# EAGLE design main (EAGLE 5.11)
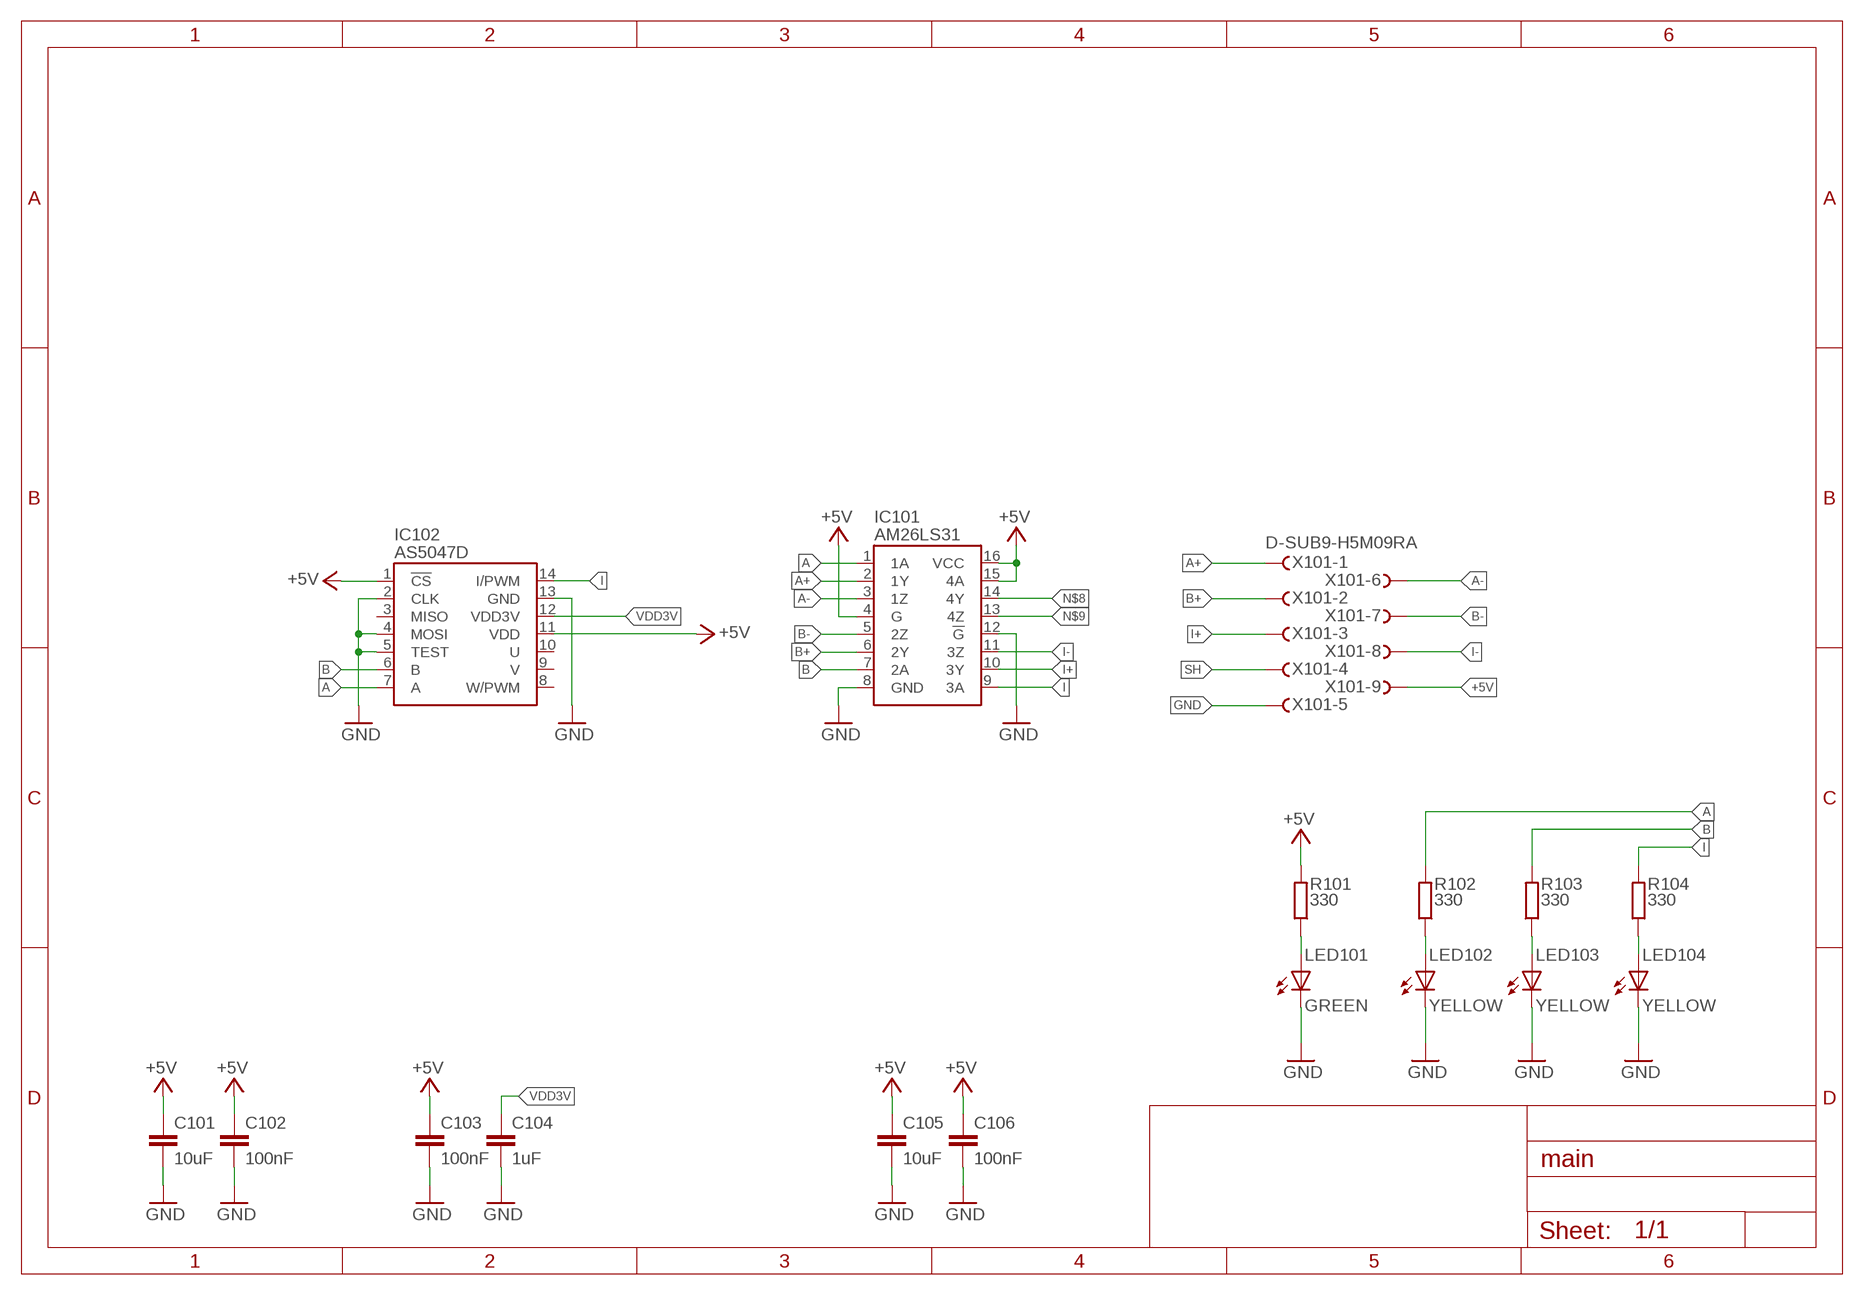
[diagram p0: schematic, sheet 1]

## Parts
C101  10uF  C-EUC0805  [C0805]
C102  100nF  C-EUC0603  [C0603]
C103  100nF  C-EUC0603  [C0603]
C104  1uF  C-EUC0805  [C0805]
C105  10uF  C-EUC0805  [C0805]
C106  100nF  C-EUC0603  [C0603]
IC101  AM26LS31  [DIL16]
IC102  AS5047D  [TSSOP14]
LED101  GREEN  LED5MM  [LED5MM]
LED102  YELLOW  LED5MM  [LED5MM]
LED103  YELLOW  LED5MM  [LED5MM]
LED104  YELLOW  LED5MM  [LED5MM]
R101  330  R-EU_0207/10  [0207/10]
R102  330  R-EU_0207/10  [0207/10]
R103  330  R-EU_0207/10  [0207/10]
R104  330  R-EU_0207/10  [0207/10]
X101  D-SUB9-H5M09RA  [H5M09RA]

## Nets
+5V: C101.1 C102.1 C103.1 C105.1 C106.1 IC101.4(G) IC101.15(4A) IC101.16(VCC) IC102.1(!CS) IC102.11(VDD) R101.2 X101.9
A: IC101.1(1A) IC102.7(A) R102.2
A+: IC101.2(1Y) X101.1
A-: IC101.3(1Z) X101.6
B: IC101.7(2A) IC102.6(B) R103.2
B+: IC101.6(2Y) X101.2
B-: IC101.5(2Z) X101.7
GND: C101.2 C102.2 C103.2 C104.2 C105.2 C106.2 IC101.8(GND) IC101.12(!G) IC102.2(CLK) IC102.4(MOSI) IC102.5(TEST) IC102.13(GND) LED101.K(C) LED102.K(C) LED103.K(C) LED104.K(C) X101.5
I: IC101.9(3A) IC102.14(I/PWM) R104.2
I+: IC101.10(3Y) X101.3
I-: IC101.11(3Z) X101.8
N$8: IC101.14(4Y)
N$9: IC101.13(4Z)
N$10: LED101.A R101.1
N$11: LED102.A R102.1
N$12: LED103.A R103.1
N$13: LED104.A R104.1
SH: X101.4
VDD3V: C104.1 IC102.12(VDD3V)
Unconnected: IC102.3(MISO) IC102.8(W/PWM) IC102.9(V) IC102.10(U)

## Library data of the parts
C101-C106 = rcl:C-EU: CAPACITOR, European symbol
IC101 = myIC:AM26LS31*
IC102 = myAMS:AS5047D
LED101-LED104 = led:LED: LED OSRAM: - CHIPLED LG R971, LG N971, LY N971, LG Q971, LY Q971, LO R971, LY R971 LH N974, LH R974 LS Q976, LO Q976, LY Q976 LO Q996 - Hyper CHIPLED LW Q18S LB Q993, LB Q99A, LB R99A - SideLED LS A670, LO A670, LY A670, LG A670, LP A670 LB A673, LV A673, LT A673, LW A673 LH A674 LY A675 LS A676, LA A676, LO A676, LY A676, LW A676 LS A679, LY A679, LG A679 - Hyper Micro SIDELED® LS Y876, LA Y876, LO Y876, LY Y876 LT Y87S - SmartLED LW L88C, LW L88S LB L89C, LB L89S, LG L890 LS L89K, LO L89K, LY L89K LS L896, LA L896, LO L896, LY L896 - TOPLED LS T670, LO T670, LY T670, LG T670, LP T670 LSG T670, LSP T670, LSY T670, LOP T670, LYG T670 LG T671, LOG T671, LSG T671 LB T673, LV T673, LT T673, LW T673 LH T674 LS T676, LA T676, LO T676, LY T676, LB T676, LH T676, LSB T676, LW T676 LB T67C, LV T67C, LT T67C, LS T67K, LO T67K, LY T67K, LW E67C LS E67B, LA E67B, LO E67B, LY E67B, LB E67C, LV E67C, LT E67C LW T67C LS T679, LY T679, LG T679 LS T770, LO T770, LY T770, LG T770, LP T770 LB T773, LV T773, LT T773, LW T773 LH T774 LS E675, LA E675, LY E675, LS T675 LS T776, LA T776, LO T776, LY T776, LB T776 LHGB T686 LT T68C, LB T68C - Hyper Mini TOPLED® LB M676 - Mini TOPLED Santana® LG M470 LS M47K, LO M47K, LY M47K Source: http://www.osram.convergy.de LUXEON: - LUMILED® LXK2-PW12-R00, LXK2-PW12-S00, LXK2-PW14-U00, LXK2-PW14-V00 LXK2-PM12-R00, LXK2-PM12-S00, LXK2-PM14-U00 LXK2-PE12-Q00, LXK2-PE12-R00, LXK2-PE12-S00, LXK2-PE14-T00, LXK2-PE14-U00 LXK2-PB12-K00, LXK2-PB12-L00, LXK2-PB12-M00, LXK2-PB14-N00, LXK2-PB14-P00, LXK2-PB14-Q00 LXK2-PR12-L00, LXK2-PR12-M00, LXK2-PR14-Q00, LXK2-PR14-R00 LXK2-PD12-Q00, LXK2-PD12-R00, LXK2-PD12-S00 LXK2-PH12-R00, LXK2-PH12-S00 LXK2-PL12-P00, LXK2-PL12-Q00, LXK2-PL12-R00 Source: www.luxeon.com KINGBRIGHT: KA-3528ASYC Source: www.kingbright.com
R101-R104 = rcl:R-EU_: RESISTOR, European symbol
X101 = con-thomas-betts:D-SUB9-: D-Subminiatur Connector Source: Electronioc Interconnects European Edition 1998; OC_FARNELL: unknown; OC_NEWARK: unknown

## Board
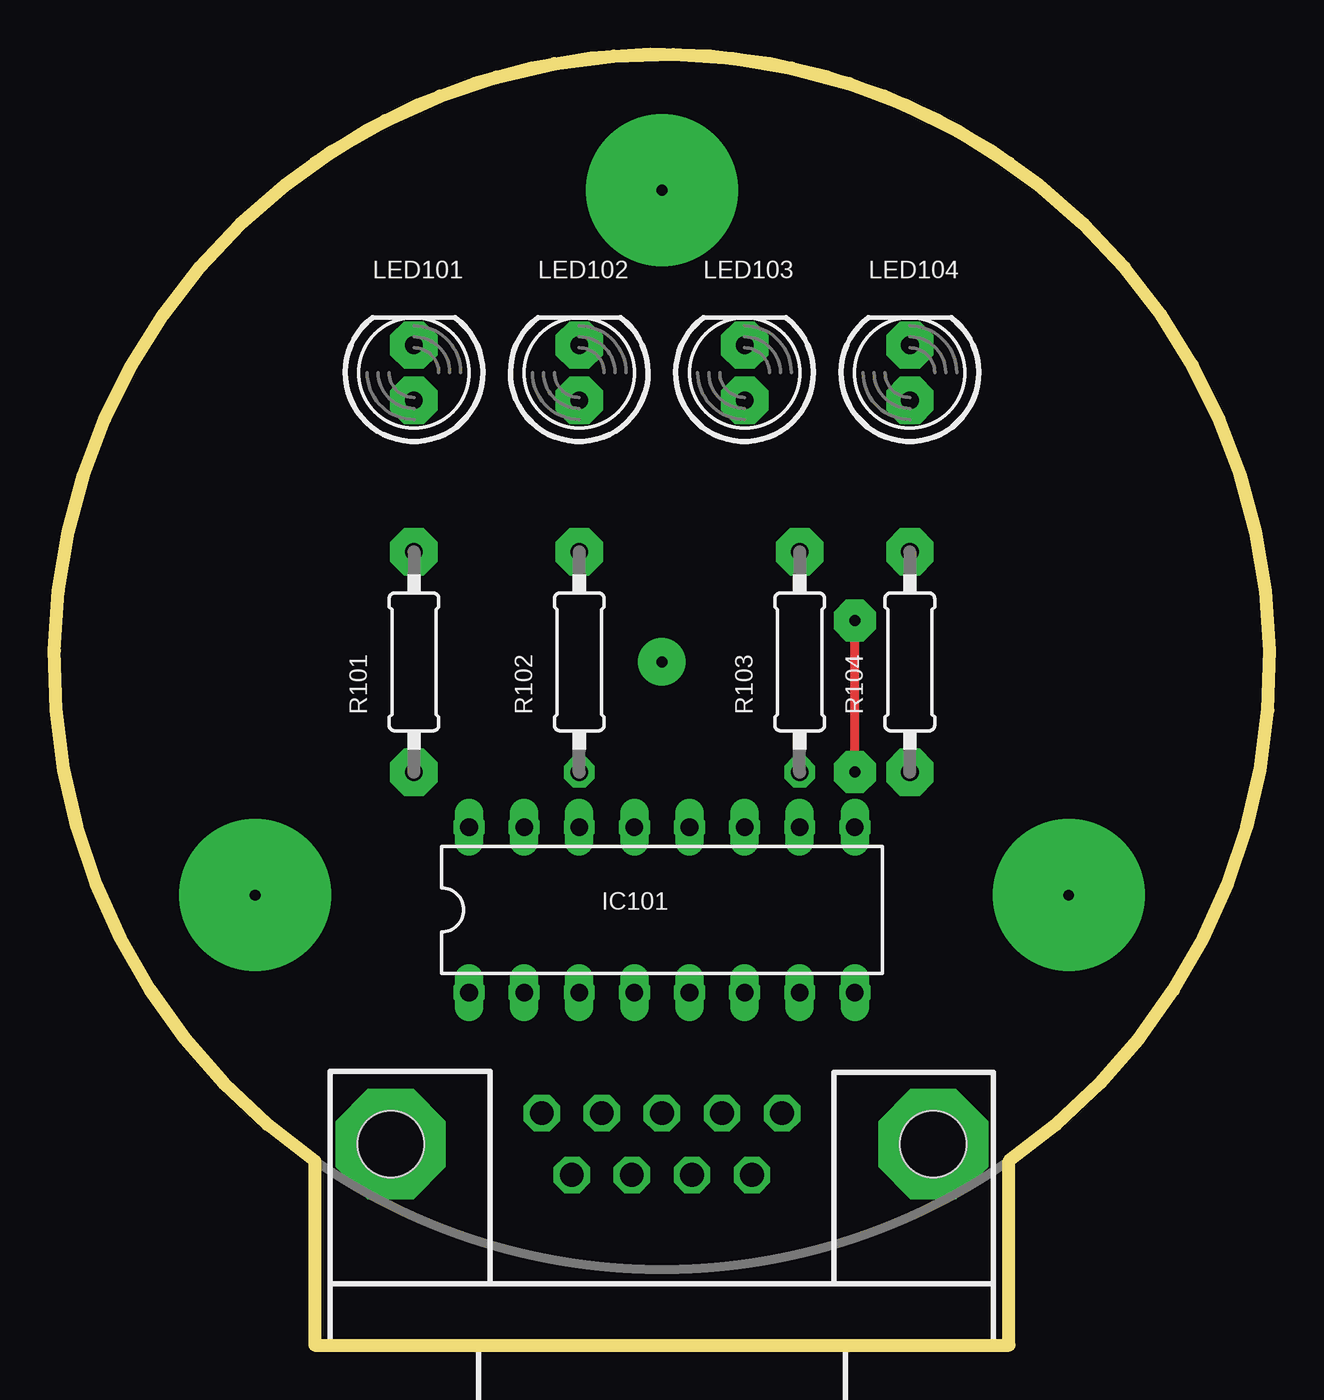
[diagram p1: board, top side]
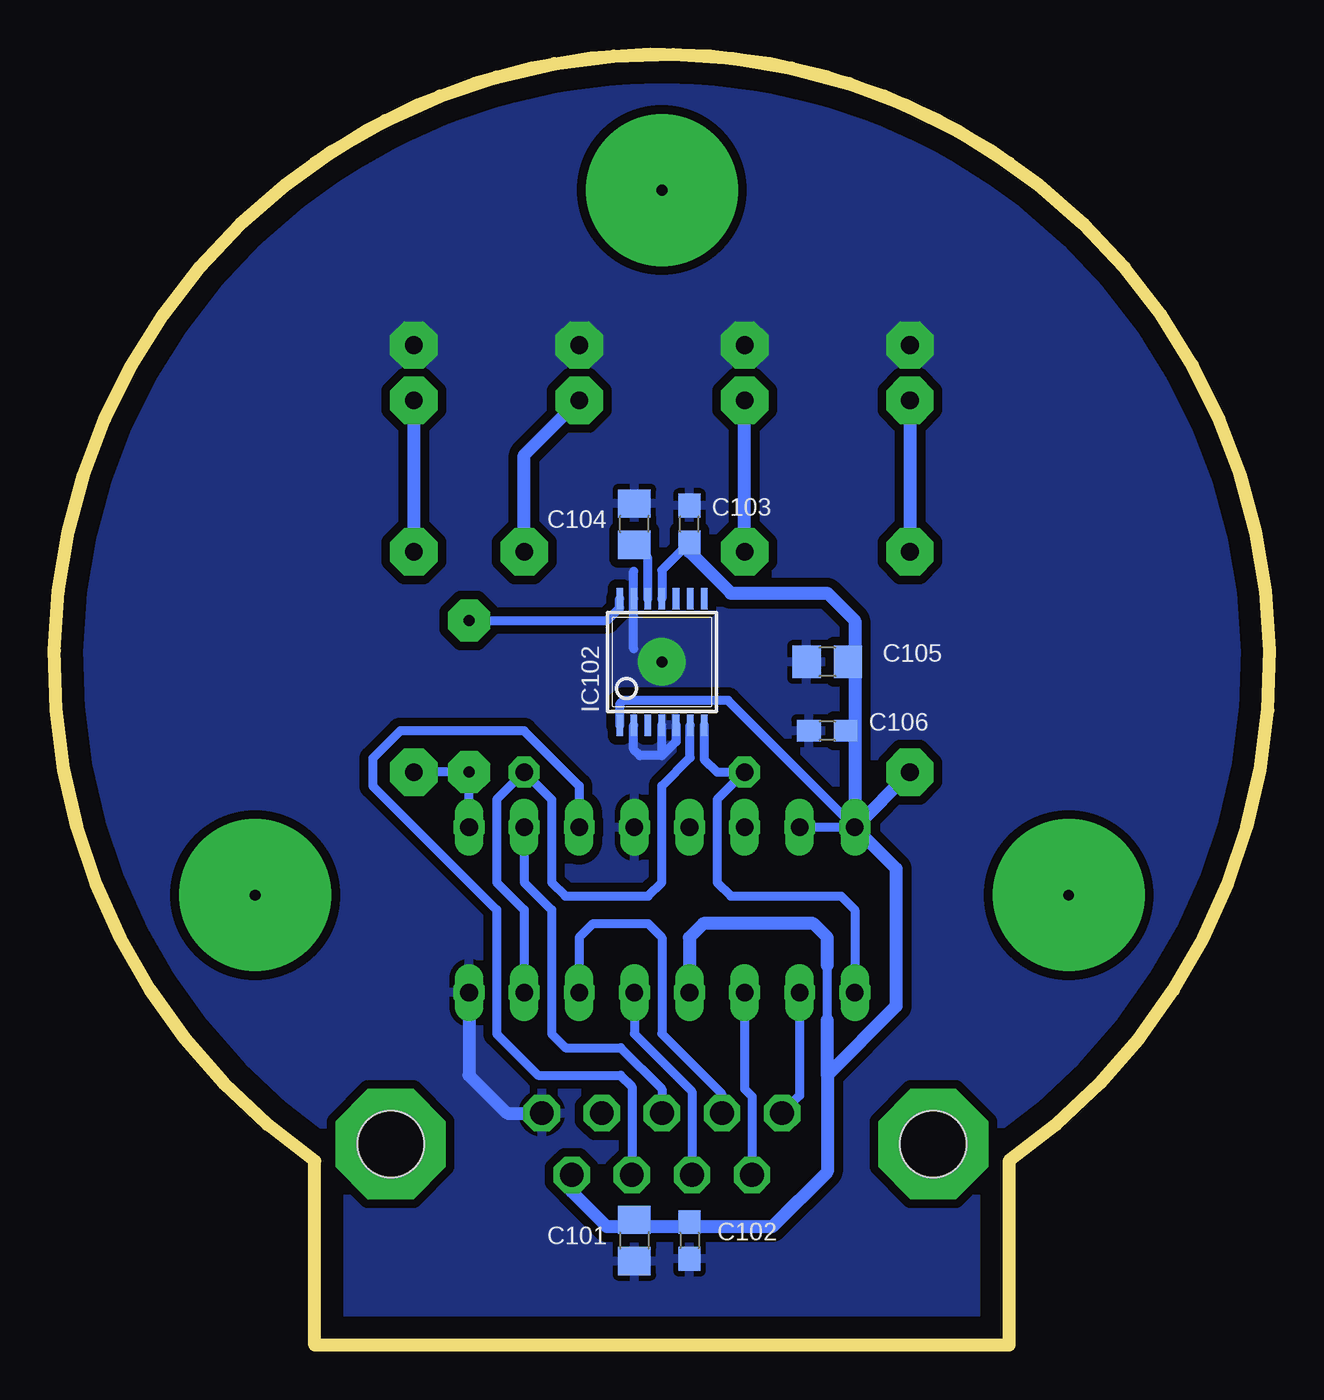
[diagram p2: board, bottom side, seen from below]

Size 56.03 x 59.51 mm. Coordinates in mm from the lower left corner, seen from the top.
Outline: 44.01,54.5 arc180 12.01,8.5 12.01,0 44.01,0 44.01,8.5 arc180 12.01,54.5
Copper layers (1*16): Top 0.035mm / dielectric 1.5mm / Bottom 0.035mm
Design rules "default *": minimum track width 10mil, minimum drill 24mil, track to track 8mil, track to pad 8mil, pad to pad 8mil, via to via 8mil, smd to smd 8mil, copper to edge 40mil, drill to drill 8mil, minimum pad ring 10mil, minimum via ring 8mil, stop-mask expansion 4mil, vias tented up to drill 0mil, thermal gap 10mil

### Footprints (pad centres in the part's own frame; a part is rotated, then mirrored left to right if it is on the bottom)
C0805 = smd 1.3 x 1.5: 1 -0.95,0; 2 0.95,0
C0603 = smd 1.1 x 1: 1 -0.85,0; 2 0.85,0
DIL16 = drill 0.813 long: 1 -8.89,-3.81; 2 -6.35,-3.81; 3 -3.81,-3.81; 4 -1.27,-3.81; 5 1.27,-3.81; 6 3.81,-3.81; 7 6.35,-3.81; 8 8.89,-3.81; 9 8.89,3.81; 10 6.35,3.81; 11 3.81,3.81; 12 1.27,3.81; 13 -1.27,3.81; 14 -3.81,3.81; 15 -6.35,3.81; 16 -8.89,3.81
TSSOP14 = smd 0.305 x 0.991: 1 -1.95,-2.918; 2 -1.3,-2.918; 3 -0.65,-2.918; 4 0,-2.918; 5 0.65,-2.918; 6 1.3,-2.918; 7 1.95,-2.918; 8 1.95,2.918; 9 1.3,2.918; 10 0.65,2.918; 11 0,2.918; 12 -0.65,2.918; 13 -1.3,2.918; 14 -1.95,2.918
LED5MM = drill 0.813 octagon: A -1.27,0; K 1.27,0
0207/10 = drill 0.813 octagon: 1 -5.08,0; 2 5.08,0
H5M09RA = drill 1.092 round: 1 -5.537,1.422; 2 -2.769,1.422; 3 0,1.422; 4 2.769,1.422; 5 5.537,1.422; 6 -4.153,-1.422; 7 -1.384,-1.422; 8 1.384,-1.422; 9 4.153,-1.422 | hole 3.048: -12.497,0; 12.497,0

### Placement (x,y rotation side)
C101  29.28,4.83 270 bottom
C102  26.74,4.83 270 bottom
C103  26.74,37.85 90 bottom
C104  29.28,37.85 90 bottom
C105  20.39,31.5 180 bottom
C106  20.39,28.32 180 bottom
IC101  28.01,20.07 0 top
IC102  28.01,31.5 0 bottom
LED101  16.58,44.84 90 top
LED102  24.2,44.84 90 top
LED103  31.82,44.84 90 top
LED104  39.44,44.84 90 top
R101  16.58,31.5 270 top
R102  24.2,31.5 270 top
R103  34.36,31.5 270 top
R104  39.44,31.5 270 top
X101  28.01,9.27 0 top

### Tracks (layer width: path | path; a pad name or v marks a point on that pad's centre or on a via)
+5V  (via drill 0.5 pad 1.42, 0.5 pad 1.68, 0.5 pad 2.18)
  Bottom 0.406: 20.39,14.99 20.39,17.53 | IC102.1 29.96,29.55 29.79,29.72 24.96,29.72 IC101.16 IC101.15 | IC102.11 28.01,35.73 C103.1 | 29.28,5.46 C101.1 | 26.74,5.46 C102.1 | 19.12,28.32 C106.1 | 19.12,31.5 C105.1
  Bottom 0.61: IC101.4 26.74,18.8 26.11,19.44 21.03,19.44 20.39,18.8 20.39,17.53 | X101.9 32.17,7.08 30.55,5.46 29.28,5.46 26.74,5.46 22.93,5.46 20.39,8 20.39,12.45 | 20.39,12.45 17.22,15.62 17.22,21.98 IC101.16 | IC101.16 19.12,28.32 19.12,31.5 19.12,33.41 20.39,34.67 24.84,34.67 26.74,36.58 C103.1 | 20.39,12.45 20.39,14.99 | IC101.16 R101.2
  other vias: 26.74,16.26 19.12,23.88 32.17,7.85 21.66,23.88 16.58,26.42
A  (via drill 0.5 pad 1.42)
  Bottom 0.406: IC101.1 19.12,20.07 19.76,20.7 24.84,20.7 25.47,21.34 25.47,25.15 R102.2 25.47,26.42 26.06,27.01 IC102.7
  other vias: 19.12,16.26 24.2,26.42
A+  (via drill 0.5 pad 1.42, 0.5 pad 1.68)
  Bottom 0.406: IC101.2 21.66,11.51 X101.1
  other vias: 21.66,16.26 22.48,10.7
A-  (via drill 0.5 pad 1.42, 0.5 pad 1.68)
  Bottom 0.406: X101.6 23.86,11.47 24.2,11.82 IC101.3
  other vias: 24.2,16.26 23.86,7.85
B  (via drill 0.5 pad 1.42)
  Bottom 0.406: IC102.6 26.71,27.09 28.01,25.79 28.01,21.34 28.65,20.7 32.46,20.7 33.09,21.34 33.09,25.15 R103.2 35.63,25.15 35.63,21.34 34.36,20.07 IC101.7
  other vias: 34.36,16.26 34.36,26.42
B+  (via drill 0.5 pad 1.42, 0.5 pad 1.68)
  Bottom 0.406: X101.2 25.24,11.59 28.01,14.36 28.01,18.8 28.65,19.44 31.19,19.44 31.82,18.8 IC101.6
  other vias: 31.82,16.26 25.24,10.7
B-  (via drill 0.5 pad 1.42, 0.5 pad 1.68)
  Bottom 0.406: X101.7 26.63,11.7 29.28,14.36 IC101.5
  other vias: 29.28,16.26 26.63,7.85
GND  (via drill 0.5 pad 1.42, 0.5 pad 1.68, 0.5 pad 2.18)
  Bottom 0.406: 29.31,32.1 IC102.13 29.31,35.69 | 28.01,27.18 IC102.4 | 28.01,27.18 29.03,27.18 29.31,27.47 IC102.2 | IC102.5 27.36,27.83 28.01,27.18
  Bottom 0.61: X101.5 35.15,10.7 36.9,12.45 IC101.8
  other vias: 29.28,23.88 36.9,16.26 33.55,10.7 28.01,31.5 16.58,46.11 24.2,46.11 31.82,46.11 39.44,46.11
  pour Bottom (isolate 0.406): 10.87,-0.88 57.22,-0.88 57.22,51.82 57.22,60.08 57.22,60.71 -1.2,60.71 -1.2,6.73 -1.2,-0.88
I  (via drill 0.5 pad 1.42, 0.5 pad 1.93, 0.5 pad 2.18)
  Top 0.406: v36.9,26.42 v36.9,33.41
  Bottom 0.406: IC101.9 v36.9,26.42 R104.2 | IC102.14 29.96,33.99 30.55,33.41 v36.9,33.41
  other vias: 36.9,23.88 39.44,26.42
I+  (via drill 0.5 pad 1.42, 0.5 pad 1.68)
  Bottom 0.406: X101.3 28.01,11.82 29.92,13.72 32.46,13.72 33.09,14.36 33.09,20.07 34.36,21.34 IC101.10
  other vias: 34.36,23.88 28.01,10.7
I-  (via drill 0.5 pad 1.42, 0.5 pad 1.68)
  Bottom 0.406: X101.8 29.4,11.93 29.92,12.45 33.73,12.45 35.63,14.36 35.63,20.07 41.35,25.79 41.35,27.05 40.08,28.32 34.36,28.32 31.82,25.79 IC101.11
  other vias: 31.82,23.88 29.4,7.85
N$1  (via drill 0.5 pad 5.08)
  other vias: 15.5,9.27
N$2  (via drill 0.5 pad 5.08)
  other vias: 40.52,9.27
N$3  (via drill 0.5 pad 7)
  other vias: 9.26,20.75
N$4  (via drill 0.5 pad 7)
  other vias: 46.76,20.75
N$5  (via drill 0.5 pad 7)
  other vias: 28.01,53.25
N$6  (via drill 0.5 pad 1.42)
  other vias: 24.2,23.88
N$7  (via drill 0.5 pad 1.42)
  other vias: 26.74,23.88
N$10  (via drill 0.5 pad 2.18)
  Bottom 0.61: v16.58,43.56 R101.1
  other vias: 16.58,36.58
N$11  (via drill 0.5 pad 2.18)
  Bottom 0.61: R102.1 v24.2,43.56
  other vias: 24.2,36.58
N$12  (via drill 0.5 pad 2.18)
  Bottom 0.61: R103.1 34.36,41.02 v31.82,43.56
  other vias: 34.36,36.58
N$13  (via drill 0.5 pad 2.18)
  Bottom 0.61: R104.1 v39.44,43.56
  other vias: 39.44,36.58
SH  (via drill 0.5 pad 1.68)
  other vias: 30.78,10.7
VDD3V
  Bottom 0.406: IC102.12 28.66,36.28 C104.1